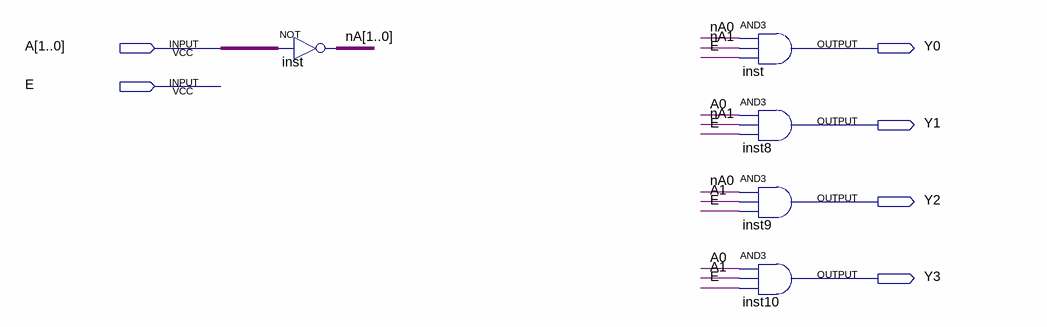
[diagram p0: schematic sheet]
// Quartus schematic DC4TO2.bdf as structural Verilog: 5 symbols, 6 pins
module DC4TO2 (
  input  [1:0] A,
  input  E,
  output Y0,
  output Y1,
  output Y2,
  output Y3
);

  wire [1:0] nA;

  assign nA = ~A;  // NOT inst, 2 bits wide
  and inst_dup2 (Y0, nA[0], nA[1], E);
  and inst8 (Y1, A[0], nA[1], E);
  and inst9 (Y2, nA[0], A[1], E);
  and inst10 (Y3, A[0], A[1], E);
endmodule
